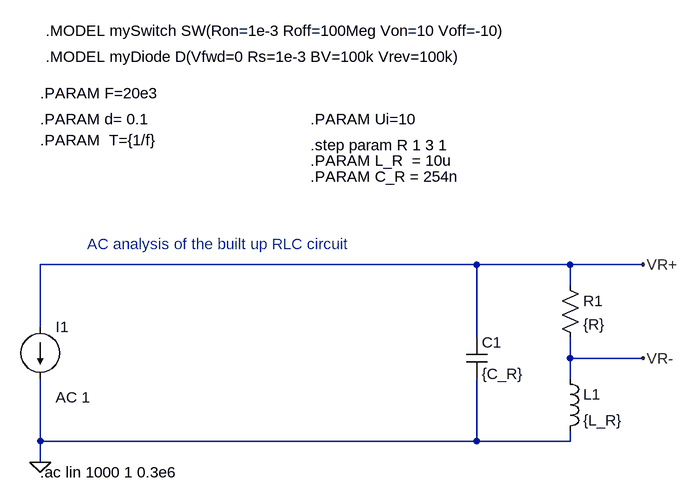
[diagram p0: schematic RLC_excited_AC.asc]
RLC_excited_AC.asc, the LTspice schematic file:
Version 4
SHEET 1 880 680
WIRE 112 144 -560 144
WIRE 256 144 112 144
WIRE 368 144 256 144
WIRE 256 176 256 144
WIRE -560 240 -560 144
WIRE 112 256 112 144
WIRE 256 288 256 256
WIRE 368 288 256 288
WIRE 256 320 256 288
WIRE -560 416 -560 320
WIRE 112 416 112 320
WIRE 112 416 -560 416
WIRE 256 416 256 400
WIRE 256 416 112 416
WIRE -560 448 -560 416
FLAG -560 448 0
FLAG 368 288 VR-
FLAG 368 144 VR+
SYMBOL res 240 160 R0
SYMATTR InstName R1
SYMATTR Value {R}
SYMBOL ind 240 304 R0
SYMATTR InstName L1
SYMATTR Value {L_R}
SYMBOL cap 96 256 R0
SYMATTR InstName C1
SYMATTR Value {C_R}
SYMBOL current -560 240 R0
WINDOW 123 24 108 Left 2
WINDOW 39 0 0 Left 0
SYMATTR InstName I1
SYMATTR Value ""
SYMATTR Value2 AC 1
TEXT -488 112 Left 2 ;AC analysis of the built up RLC circuit
TEXT -144 -80 Left 2 !.PARAM Ui=10
TEXT -144 -40 Left 2 !.step param R 1 3 1
TEXT -560 -120 Left 2 !.PARAM F=20e3
TEXT -560 -80 Left 2 !.PARAM d= 0.1
TEXT -560 -48 Left 2 !.PARAM  T={1/f}
TEXT -552 -216 Left 2 !.MODEL mySwitch SW(Ron=1e-3 Roff=100Meg Von=10 Voff=-10)
TEXT -552 -176 Left 2 !.MODEL myDiode D(Vfwd=0 Rs=1e-3 BV=100k Vrev=100k)
TEXT -144 -16 Left 2 !.PARAM L_R  = 10u
TEXT -144 8 Left 2 !.PARAM C_R = 254n
TEXT -560 464 Left 2 !.ac lin 1000 1 0.3e6

The netlist it stands for:
* RLC_excited_AC.asc
R1 VR+ VR- {R}
L1 VR- 0 {L_R}
C1 VR+ 0 {C_R}
I1 VR+ 0 AC 1
* AC analysis of the built up RLC circuit
.PARAM Ui=10
.step param R 1 3 1
.PARAM F=20e3
.PARAM d= 0.1
.PARAM  T={1/f}
.MODEL mySwitch SW(Ron=1e-3 Roff=100Meg Von=10 Voff=-10)
.MODEL myDiode D(Vfwd=0 Rs=1e-3 BV=100k Vrev=100k)
.PARAM L_R  = 10u
.PARAM C_R = 254n
.ac lin 1000 1 0.3e6
.backanno
.end

* Results of the author's LTspice run, read from the files saved beside the schematic
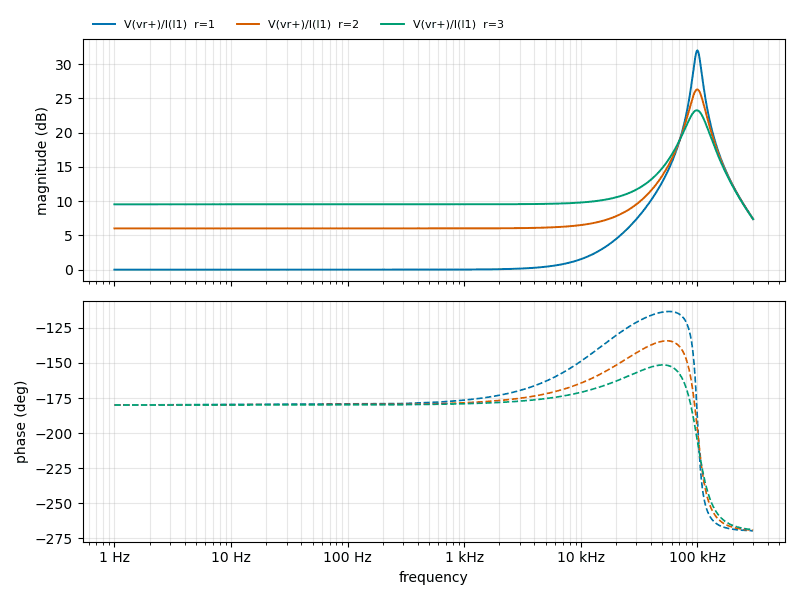
[diagram p1: AC Analysis of RLC_excited_AC.asc, plotted from the saved traces]
* AC Analysis, 3 runs:
*   V(vr+)/I(I1) [r=1]: 0.01 dB at 1 Hz, 7.41 dB at 300 kHz, peak 32.00 dB at 99.7 kHz, 3 dB below the peak at 92.18 kHz and 108.1 kHz
*   V(vr+)/I(I1) [r=2]: 6.02 dB at 1 Hz, 7.40 dB at 300 kHz, peak 26.30 dB at 99.7 kHz, 3 dB below the peak at 84.73 kHz and 116.6 kHz
*   V(vr+)/I(I1) [r=3]: 9.55 dB at 1 Hz, 7.39 dB at 300 kHz, peak 23.26 dB at 98.8 kHz, 3 dB below the peak at 76.63 kHz and 124.5 kHz